# Altium schematic sheet STM32H730_PINOUT.SchDoc
size D; SheetNumber: 2; SheetTotal: 5
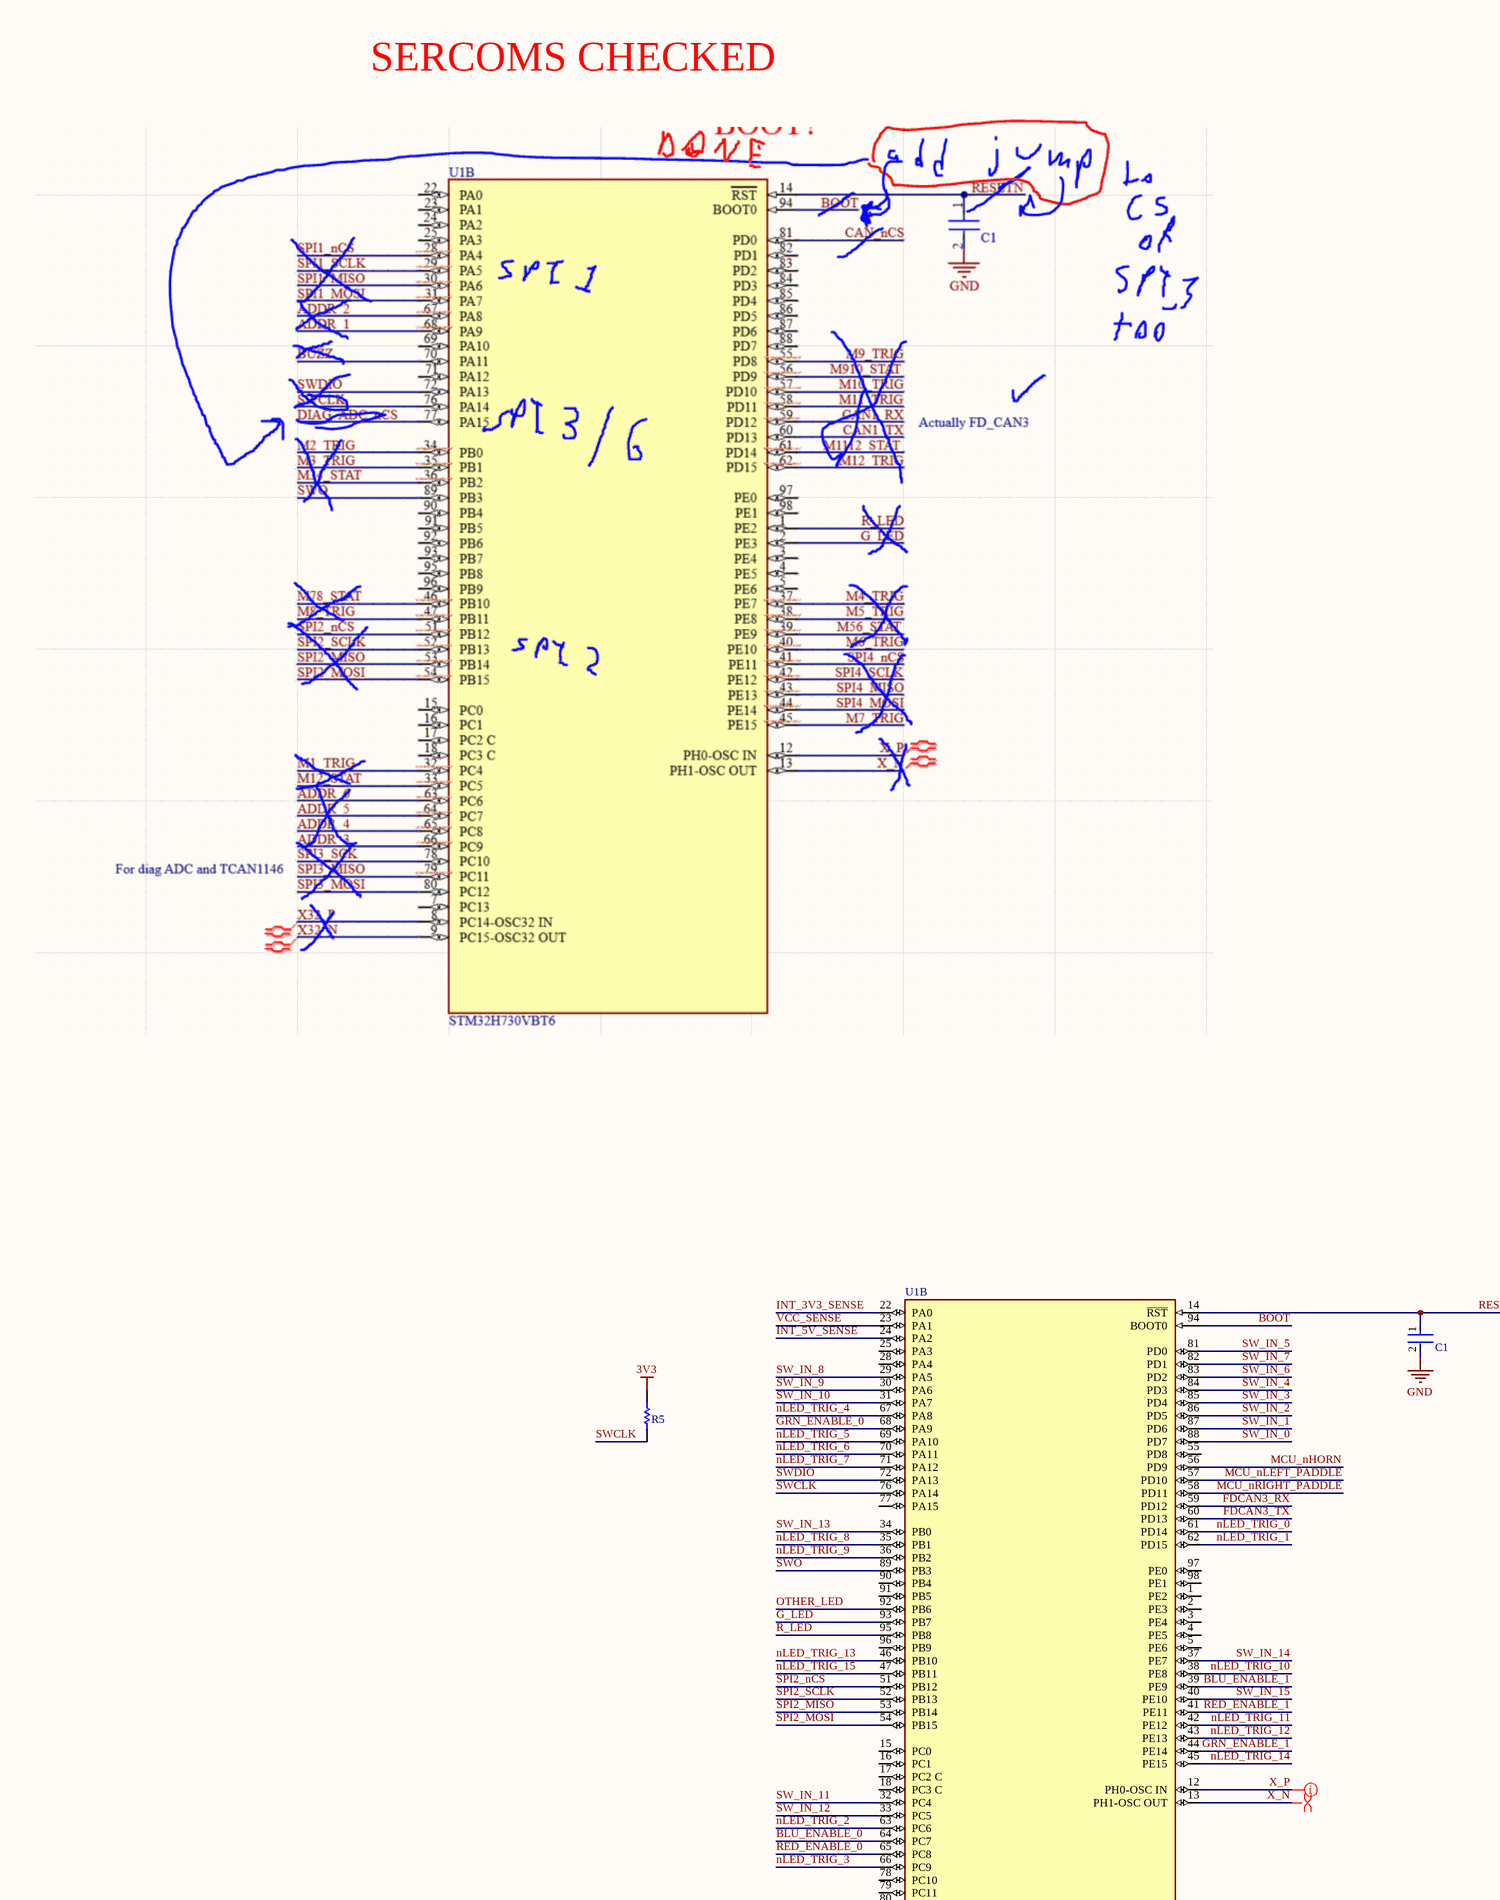
[diagram p0: STM32H730_PINOUT.SchDoc, top left]
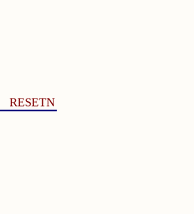
[diagram p1: STM32H730_PINOUT.SchDoc, top middle]
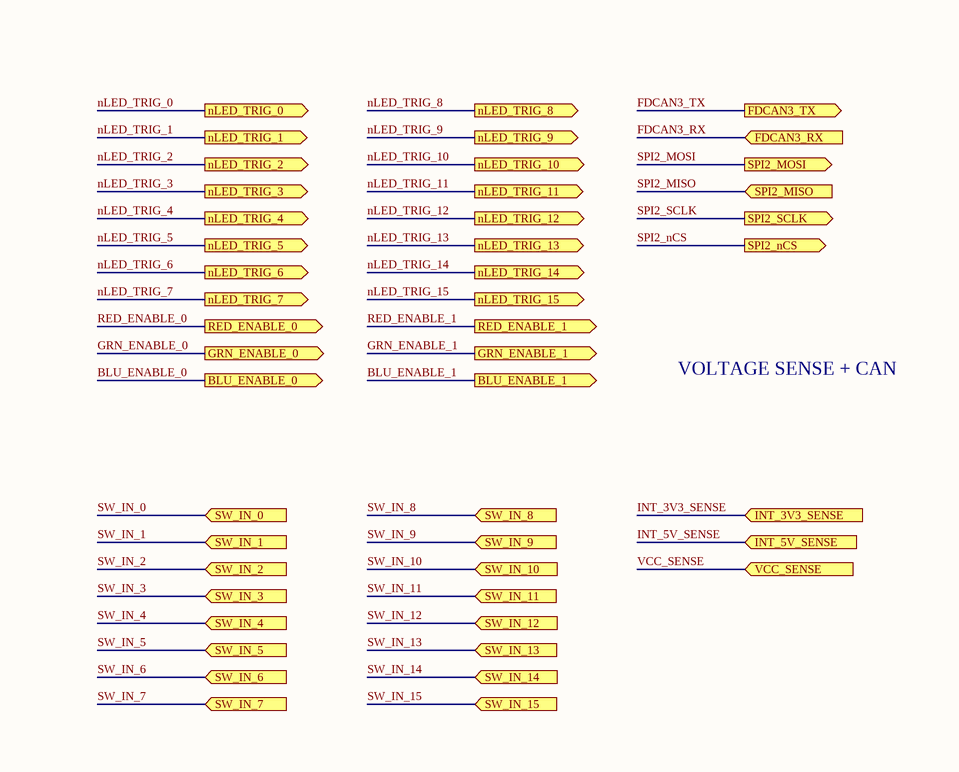
[diagram p2: STM32H730_PINOUT.SchDoc, top right]
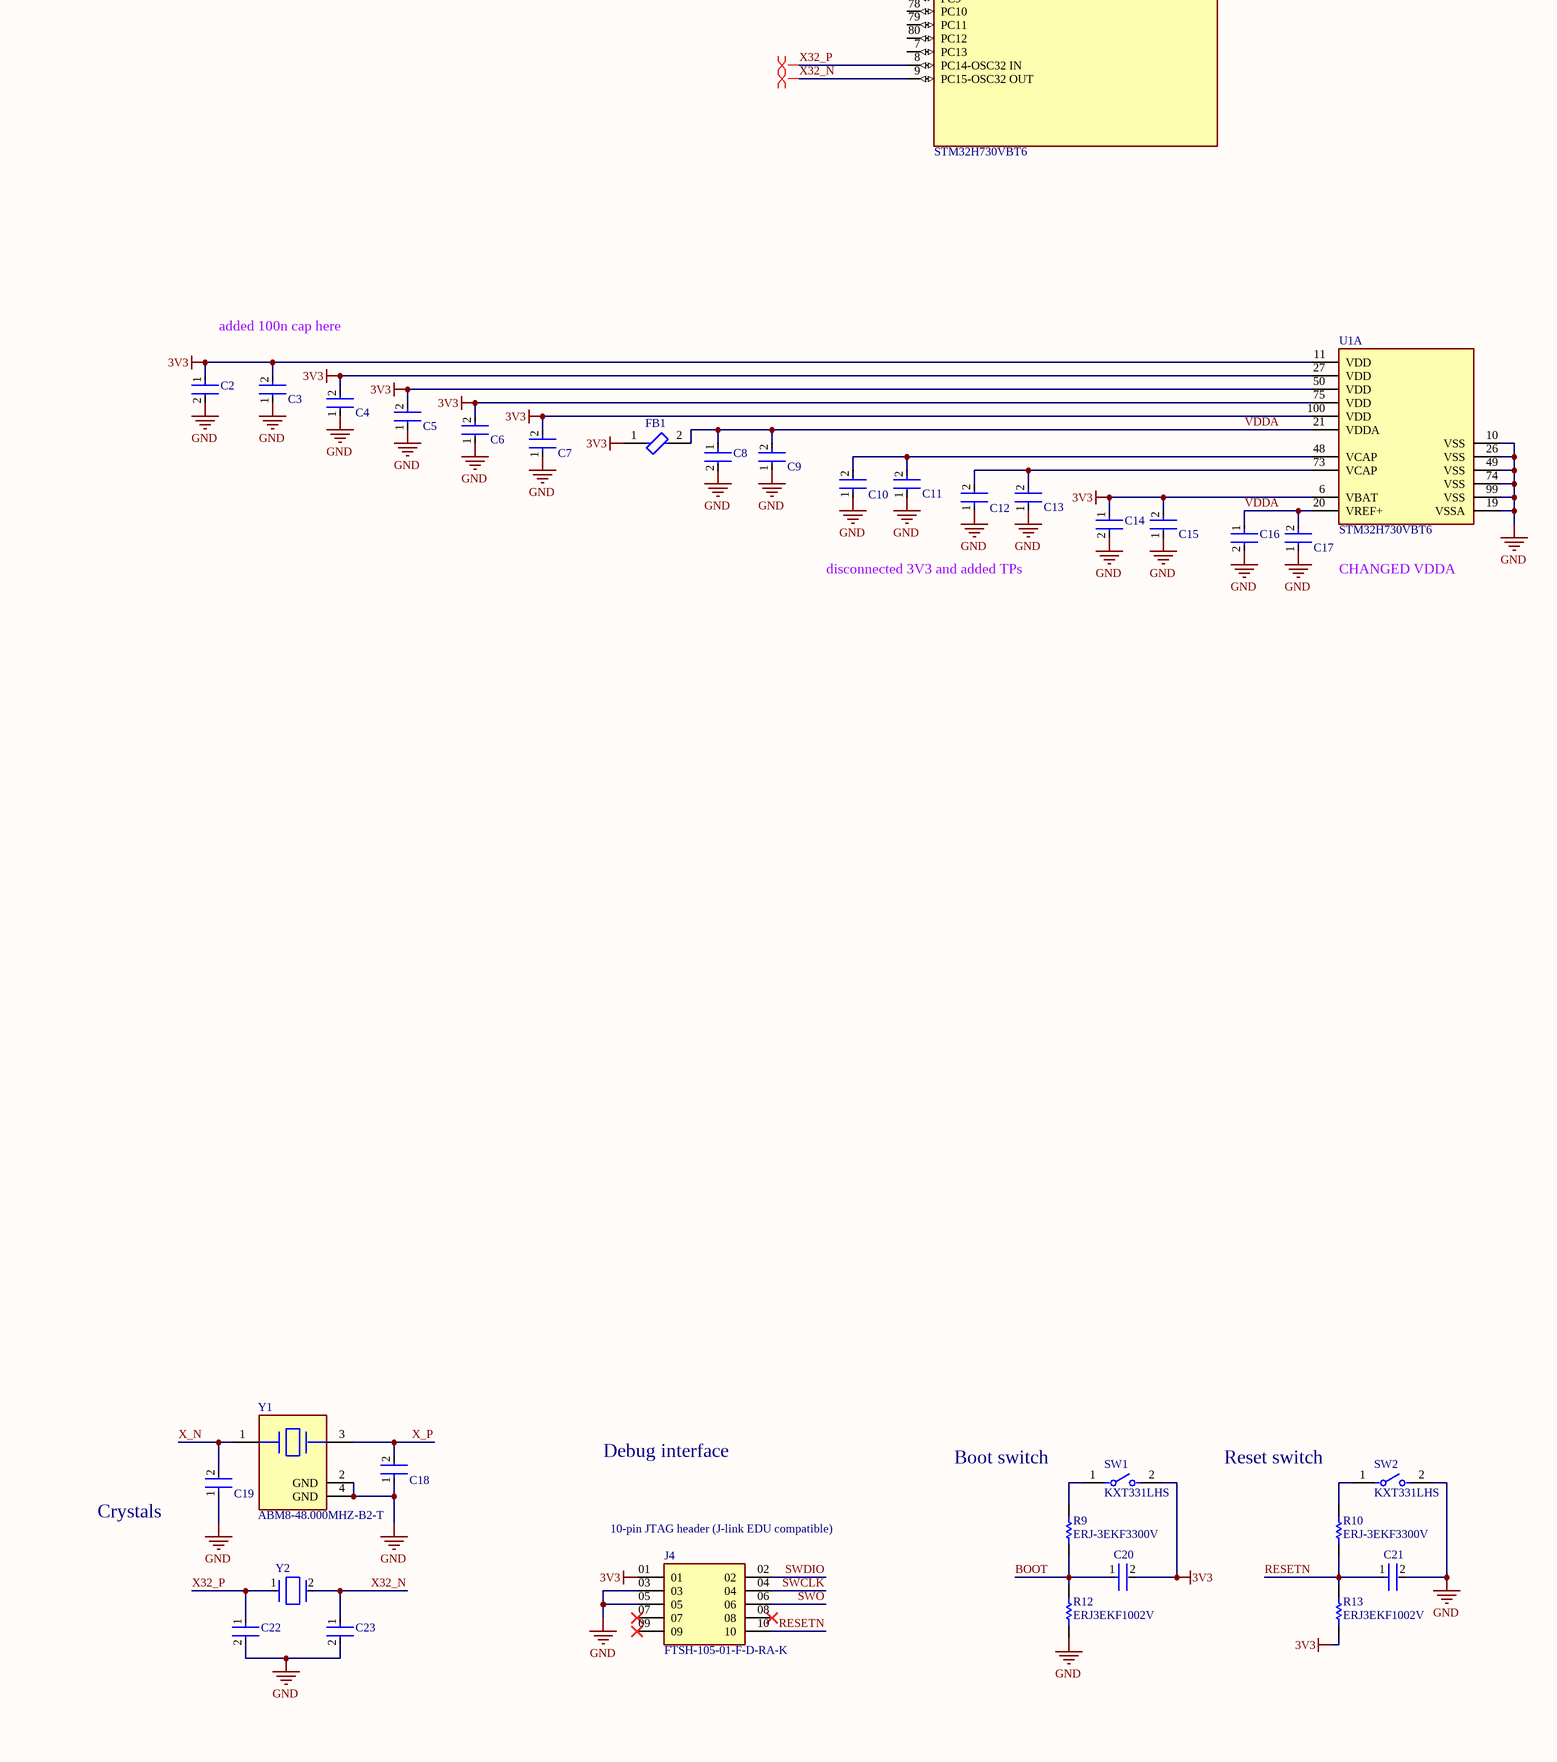
[diagram p3: STM32H730_PINOUT.SchDoc, bottom left]
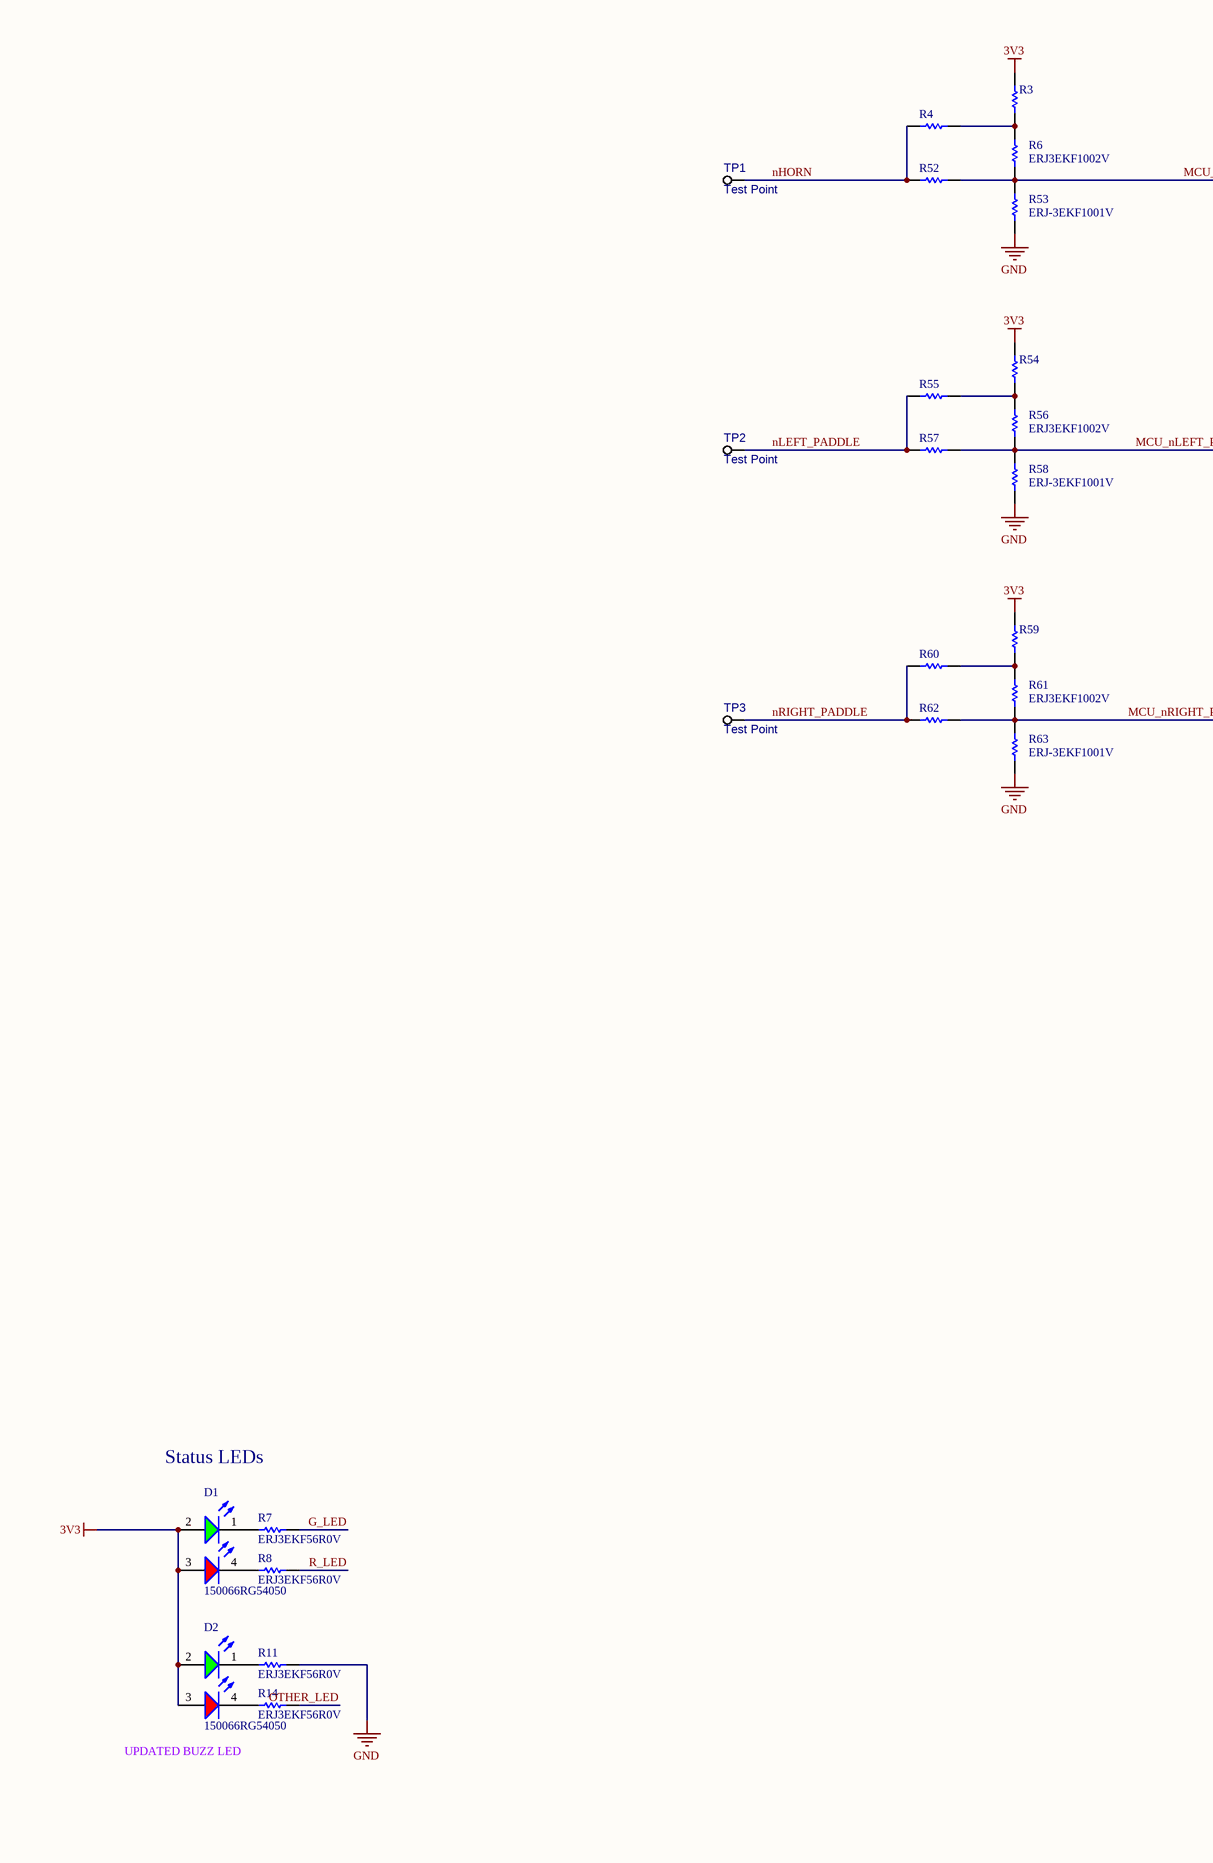
[diagram p4: STM32H730_PINOUT.SchDoc, bottom middle]
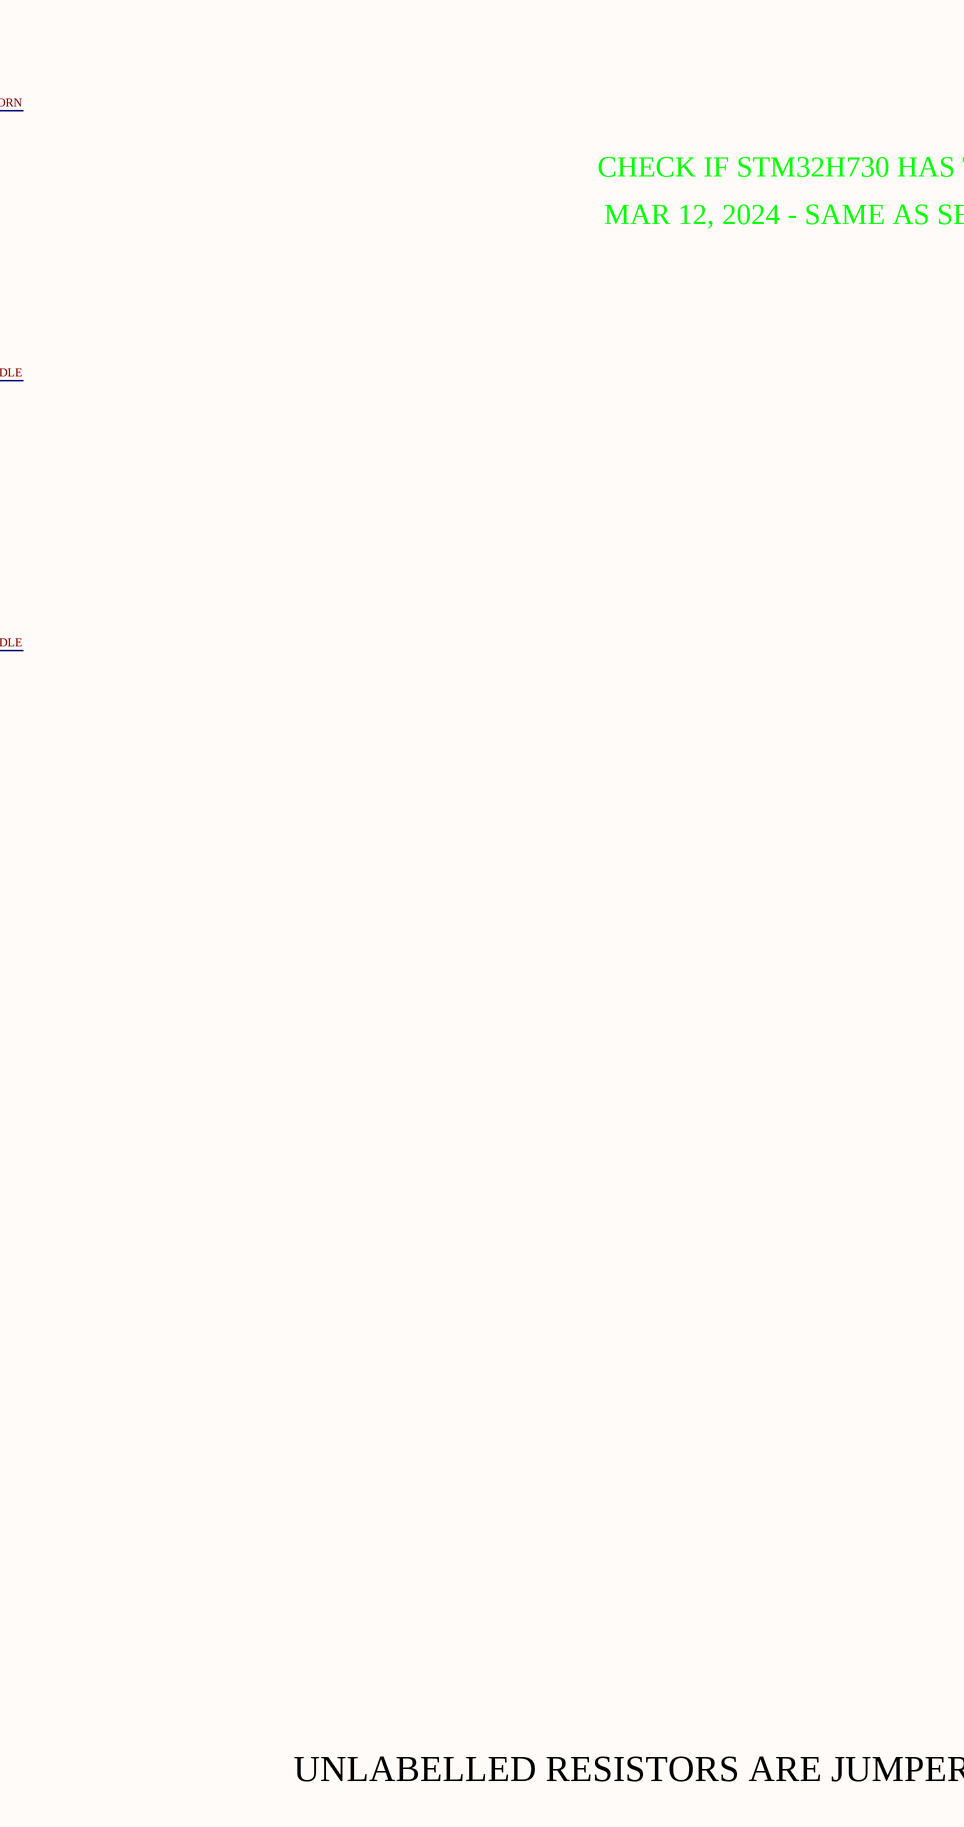
[diagram p5: STM32H730_PINOUT.SchDoc, bottom right]

## Parts
C1  C0402C104K8PACTU  [FP-C0402-BB-MFG]  (value not drawn)
C2  C1005X5R1A475K050BC  [FP-C1005-050-0_15-MFG]  (value not drawn)
C3  GRM155R71C104KA88D  [FP-GRM15-MFG]  (value not drawn)
C4  GRM155R71C104KA88D  [FP-GRM15-MFG]  (value not drawn)
C5  GRM155R71C104KA88D  [FP-GRM15-MFG]  (value not drawn)
C6  GRM155R71C104KA88D  [FP-GRM15-MFG]  (value not drawn)
C7  GRM155R71C104KA88D  [FP-GRM15-MFG]  (value not drawn)
C8  EMK105BJ105KV-F  [FP-0402-L_1_0_0_05-W_0_5-IPC_A]  (value not drawn)
C9  GRM155R71C104KA88D  [FP-GRM15-MFG]  (value not drawn)
C10  C1005X7S1A225K050BC  [FP-C1005-050-0_15-0_1-MFG]  (value not drawn)
C11  GRM155R71C104KA88D  [FP-GRM15-MFG]  (value not drawn)
C12  C1005X7S1A225K050BC  [FP-C1005-050-0_15-0_1-MFG]  (value not drawn)
C13  GRM155R71C104KA88D  [FP-GRM15-MFG]  (value not drawn)
C14  EMK105BJ105KV-F  [FP-0402-L_1_0_0_05-W_0_5-IPC_A]  (value not drawn)
C15  GRM155R71C104KA88D  [FP-GRM15-MFG]  (value not drawn)
C16  EMK105BJ105KV-F  [FP-0402-L_1_0_0_05-W_0_5-IPC_A]  (value not drawn)
C17  GRM155R71C104KA88D  [FP-GRM15-MFG]  (value not drawn)
C18  08051A6R8CAT2A  [FP-0805-L_2_01_0_2-W_1_25-MFG]  (value not drawn)
C19  08051A6R8CAT2A  [FP-0805-L_2_01_0_2-W_1_25-MFG]  (value not drawn)
C20  C0402C104K8PACTU  [FP-C0402-BB-MFG]  (value not drawn)
C21  C0402C104K8PACTU  [FP-C0402-BB-MFG]  (value not drawn)
C22  04025A180FAT2A  [FP-0402-L_1_0_1-W_0_5_0_1-IPC_A]  (value not drawn)
C23  04025A180FAT2A  [FP-0402-L_1_0_1-W_0_5_0_1-IPC_A]  (value not drawn)
D1  150066RG54050  [WL-SBCD_0606]
D2  150066RG54050  [WL-SBCD_0606]
FB1  BLM15PX601SN1D  [FP-BLM15-0_05-MFG]  (value not drawn)
J4  FTSH-105-01-F-D-RA-K  [FTSH-105-01-F-D-RA-K-Footprint-1]
R3  0402 JUMPER  [RESC1005X40X25ML05T05]  (value not drawn)
R4  0402 JUMPER  [RESC1005X40X25ML05T05]  (value not drawn)
R5  ERJ3EKF1002V  [RESC1609X55X30LL15T15]  (value not drawn)
R6  ERJ3EKF1002V  [RESC1609X55X30LL15T15]
R7  ERJ3EKF56R0V  [RESC1608X55X30NL15T15]
R8  ERJ3EKF56R0V  [RESC1608X55X30NL15T15]
R9  ERJ-3EKF3300V  [RESC1608X55X30LL15T15]
R10  ERJ-3EKF3300V  [RESC1608X55X30LL15T15]
R11  ERJ3EKF56R0V  [RESC1608X55X30NL15T15]
R12  ERJ3EKF1002V  [RESC1609X55X30LL15T15]
R13  ERJ3EKF1002V  [RESC1609X55X30LL15T15]
R14  ERJ3EKF56R0V  [RESC1608X55X30NL15T15]
R52  0402 JUMPER  [RESC1005X40X25ML05T05]  (value not drawn)
R53  ERJ-3EKF1001V  [RESC1608X55X30LL15T15]
R54  0402 JUMPER  [RESC1005X40X25ML05T05]  (value not drawn)
R55  0402 JUMPER  [RESC1005X40X25ML05T05]  (value not drawn)
R56  ERJ3EKF1002V  [RESC1609X55X30LL15T15]
R57  0402 JUMPER  [RESC1005X40X25ML05T05]  (value not drawn)
R58  ERJ-3EKF1001V  [RESC1608X55X30LL15T15]
R59  0402 JUMPER  [RESC1005X40X25ML05T05]  (value not drawn)
R60  0402 JUMPER  [RESC1005X40X25ML05T05]  (value not drawn)
R61  ERJ3EKF1002V  [RESC1609X55X30LL15T15]
R62  0402 JUMPER  [RESC1005X40X25ML05T05]  (value not drawn)
R63  ERJ-3EKF1001V  [RESC1608X55X30LL15T15]
SW1  KXT331LHS  [FP-KXT331LHS-MFG]
SW2  KXT331LHS  [FP-KXT331LHS-MFG]
TP1  Test Point  [TP-SMT-1mm]  (no BOM)
TP2  Test Point  [TP-SMT-1mm]  (no BOM)
TP3  Test Point  [TP-SMT-1mm]  (no BOM)
U1  STM32H730VBT6  [FP-LQFP100-1L-IPC_C]  (parts A,B of 2)
Y1  ABM8-48.000MHZ-B2-T  [FP-ABM8-MFG]
Y2  ECS-.327-12.5-1210-TR  [FP-ECX-1210-MFG]  (value not drawn)

## Ports
BLU_ENABLE_0 (out, see STEERING_WHEEL_SWITCHES_V2_CONTROLLER[5B]), BLU_ENABLE_1 (out, see STEERING_WHEEL_SWITCHES_V2_CONTROLLER[5B]), FDCAN3_RX (in, see STEERING_WHEEL_SWITCHES_V2_CONTROLLER[4B]), FDCAN3_TX (out, see STEERING_WHEEL_SWITCHES_V2_CONTROLLER[4B]), GRN_ENABLE_0 (out, see STEERING_WHEEL_SWITCHES_V2_CONTROLLER[5B]), GRN_ENABLE_1 (out, see STEERING_WHEEL_SWITCHES_V2_CONTROLLER[5B]), INT_3V3_SENSE (in, see STEERING_WHEEL_SWITCHES_V2_CONTROLLER[4A], PWR_MGMT[4B]), INT_5V_SENSE (in, see STEERING_WHEEL_SWITCHES_V2_CONTROLLER[4A], PWR_MGMT[4C]), nLED_TRIG_0 (out, see STEERING_WHEEL_SWITCHES_V2_CONTROLLER[5A], LED_ARRAY[1A]), nLED_TRIG_1 (out, see STEERING_WHEEL_SWITCHES_V2_CONTROLLER[5A], LED_ARRAY[1A]), nLED_TRIG_2 (out, see STEERING_WHEEL_SWITCHES_V2_CONTROLLER[5A], LED_ARRAY[1A]), nLED_TRIG_3 (out, see STEERING_WHEEL_SWITCHES_V2_CONTROLLER[5A], LED_ARRAY[1A]), nLED_TRIG_4 (out, see STEERING_WHEEL_SWITCHES_V2_CONTROLLER[5A], LED_ARRAY[1A]), nLED_TRIG_5 (out, see STEERING_WHEEL_SWITCHES_V2_CONTROLLER[5A], LED_ARRAY[1A]), nLED_TRIG_6 (out, see STEERING_WHEEL_SWITCHES_V2_CONTROLLER[5A], LED_ARRAY[1A]), nLED_TRIG_7 (out, see STEERING_WHEEL_SWITCHES_V2_CONTROLLER[5A], LED_ARRAY[1A]), nLED_TRIG_8 (out, see STEERING_WHEEL_SWITCHES_V2_CONTROLLER[5B]), nLED_TRIG_9 (out, see STEERING_WHEEL_SWITCHES_V2_CONTROLLER[5B]), nLED_TRIG_10 (out, see STEERING_WHEEL_SWITCHES_V2_CONTROLLER[5B]), nLED_TRIG_11 (out, see STEERING_WHEEL_SWITCHES_V2_CONTROLLER[5B]), nLED_TRIG_12 (out, see STEERING_WHEEL_SWITCHES_V2_CONTROLLER[5B]), nLED_TRIG_13 (out, see STEERING_WHEEL_SWITCHES_V2_CONTROLLER[5B]), nLED_TRIG_14 (out, see STEERING_WHEEL_SWITCHES_V2_CONTROLLER[5B]), nLED_TRIG_15 (out, see STEERING_WHEEL_SWITCHES_V2_CONTROLLER[5B]), RED_ENABLE_0 (out, see STEERING_WHEEL_SWITCHES_V2_CONTROLLER[5B]), RED_ENABLE_1 (out, see STEERING_WHEEL_SWITCHES_V2_CONTROLLER[5B]), SPI2_MISO (in, see STEERING_WHEEL_SWITCHES_V2_CONTROLLER[4B]), SPI2_MOSI (out, see STEERING_WHEEL_SWITCHES_V2_CONTROLLER[4B]), SPI2_nCS (out, see STEERING_WHEEL_SWITCHES_V2_CONTROLLER[4B]), SPI2_SCLK (out, see STEERING_WHEEL_SWITCHES_V2_CONTROLLER[4B]), SW_IN_0 (in, see STEERING_WHEEL_SWITCHES_V2_CONTROLLER[4B]), SW_IN_1 (in, see STEERING_WHEEL_SWITCHES_V2_CONTROLLER[4B]), SW_IN_2 (in, see STEERING_WHEEL_SWITCHES_V2_CONTROLLER[4B]), SW_IN_3 (in, see STEERING_WHEEL_SWITCHES_V2_CONTROLLER[4C]), SW_IN_4 (in, see STEERING_WHEEL_SWITCHES_V2_CONTROLLER[4C]), SW_IN_5 (in, see STEERING_WHEEL_SWITCHES_V2_CONTROLLER[4C]), SW_IN_6 (in, see STEERING_WHEEL_SWITCHES_V2_CONTROLLER[4C]), SW_IN_7 (in, see STEERING_WHEEL_SWITCHES_V2_CONTROLLER[4C]), SW_IN_8 (in, see STEERING_WHEEL_SWITCHES_V2_CONTROLLER[4C]), SW_IN_9 (in, see STEERING_WHEEL_SWITCHES_V2_CONTROLLER[4C]), SW_IN_10 (in, see STEERING_WHEEL_SWITCHES_V2_CONTROLLER[4C]), SW_IN_11 (in, see STEERING_WHEEL_SWITCHES_V2_CONTROLLER[4C]), SW_IN_12 (in, see STEERING_WHEEL_SWITCHES_V2_CONTROLLER[4C]), SW_IN_13 (in, see STEERING_WHEEL_SWITCHES_V2_CONTROLLER[4C]), SW_IN_14 (in, see STEERING_WHEEL_SWITCHES_V2_CONTROLLER[4C]), SW_IN_15 (in, see STEERING_WHEEL_SWITCHES_V2_CONTROLLER[4C]), VCC_SENSE (in, see STEERING_WHEEL_SWITCHES_V2_CONTROLLER[4A], PWR_MGMT[3C])

## Nets
3V3: C2.1 C3.2 C4.2 C5.2 C6.2 C7.2 C14.1 C15.2 C20.2 D1.2(A) D1.3(A) D2.2(A) D2.3(A) FB1.1 J4.01 R3.2 R5.1 R13.1 R54.2 R59.2 SW1.2 U1.6(VBAT) U1.11(VDD) U1.27(VDD) U1.50(VDD) U1.75(VDD) U1.100(VDD)
GND: C1.2 C2.2 C3.1 C4.1 C5.1 C6.1 C7.1 C8.2 C9.1 C10.1 C11.1 C12.1 C13.1 C14.2 C15.1 C16.2 C17.1 C18.1 C19.1 C21.2 C22.2 C23.2 J4.03 J4.05 R11.1 R12.1 R53.1 R58.1 R63.1 SW2.2 U1.10(VSS) U1.19(VSSA) U1.26(VSS) U1.49(VSS) U1.74(VSS) U1.99(VSS) Y1.2(GND) Y1.4(GND)
BLU_ENABLE_0: U1.64(PC7) ; port BLU_ENABLE_0
BLU_ENABLE_1: U1.39(PE9) ; port BLU_ENABLE_1
BOOT: C20.1 R9.1 R12.2 U1.94(BOOT0)
FDCAN3_RX: U1.59(PD12) ; port FDCAN3_RX
FDCAN3_TX: U1.60(PD13) ; port FDCAN3_TX
G_LED: R7.1 U1.93(PB7)
GRN_ENABLE_0: U1.68(PA9) ; port GRN_ENABLE_0
GRN_ENABLE_1: U1.44(PE14) ; port GRN_ENABLE_1
INT_3V3_SENSE: U1.22(PA0) ; port INT_3V3_SENSE
INT_5V_SENSE: U1.24(PA2) ; port INT_5V_SENSE
MCU_nHORN: R6.2 R52.2 R53.2 U1.56(PD9)
MCU_nLEFT_PADDLE: R56.2 R57.2 R58.2 U1.57(PD10)
MCU_nRIGHT_PADDLE: R61.2 R62.2 R63.2 U1.58(PD11)
nHORN: R4.1 R52.1 TP1.1(Pad)
nLED_TRIG_0: U1.61(PD14) ; port nLED_TRIG_0
nLED_TRIG_1: U1.62(PD15) ; port nLED_TRIG_1
nLED_TRIG_2: U1.63(PC6) ; port nLED_TRIG_2
nLED_TRIG_3: U1.66(PC9) ; port nLED_TRIG_3
nLED_TRIG_4: U1.67(PA8) ; port nLED_TRIG_4
nLED_TRIG_5: U1.69(PA10) ; port nLED_TRIG_5
nLED_TRIG_6: U1.70(PA11) ; port nLED_TRIG_6
nLED_TRIG_7: U1.71(PA12) ; port nLED_TRIG_7
nLED_TRIG_8: U1.35(PB1) ; port nLED_TRIG_8
nLED_TRIG_9: U1.36(PB2) ; port nLED_TRIG_9
nLED_TRIG_10: U1.38(PE8) ; port nLED_TRIG_10
nLED_TRIG_11: U1.42(PE12) ; port nLED_TRIG_11
nLED_TRIG_12: U1.43(PE13) ; port nLED_TRIG_12
nLED_TRIG_13: U1.46(PB10) ; port nLED_TRIG_13
nLED_TRIG_14: U1.45(PE15) ; port nLED_TRIG_14
nLED_TRIG_15: U1.47(PB11) ; port nLED_TRIG_15
nLEFT_PADDLE: R55.1 R57.1 TP2.1(Pad)
nRIGHT_PADDLE: R60.1 R62.1 TP3.1(Pad)
OTHER_LED: R14.1 U1.92(PB6)
R_LED: R8.1 U1.95(PB8)
RED_ENABLE_0: U1.65(PC8) ; port RED_ENABLE_0
RED_ENABLE_1: U1.41(PE11) ; port RED_ENABLE_1
RESETN: C1.1 C21.1 J4.10 R10.1 R13.2 U1.14(~{RST})
SPI2_MISO: U1.53(PB14) ; port SPI2_MISO
SPI2_MOSI: U1.54(PB15) ; port SPI2_MOSI
SPI2_nCS: U1.51(PB12) ; port SPI2_nCS
SPI2_SCLK: U1.52(PB13) ; port SPI2_SCLK
SW_IN_0: U1.88(PD7) ; port SW_IN_0
SW_IN_1: U1.87(PD6) ; port SW_IN_1
SW_IN_2: U1.86(PD5) ; port SW_IN_2
SW_IN_3: U1.85(PD4) ; port SW_IN_3
SW_IN_4: U1.84(PD3) ; port SW_IN_4
SW_IN_5: U1.81(PD0) ; port SW_IN_5
SW_IN_6: U1.83(PD2) ; port SW_IN_6
SW_IN_7: U1.82(PD1) ; port SW_IN_7
SW_IN_8: U1.29(PA5) ; port SW_IN_8
SW_IN_9: U1.30(PA6) ; port SW_IN_9
SW_IN_10: U1.31(PA7) ; port SW_IN_10
SW_IN_11: U1.32(PC4) ; port SW_IN_11
SW_IN_12: U1.33(PC5) ; port SW_IN_12
SW_IN_13: U1.34(PB0) ; port SW_IN_13
SW_IN_14: U1.37(PE7) ; port SW_IN_14
SW_IN_15: U1.40(PE10) ; port SW_IN_15
SWCLK: J4.04 R5.2 U1.76(PA14)
SWDIO: J4.02 U1.72(PA13)
SWO: J4.06 U1.89(PB3)
VCC_SENSE: U1.23(PA1) ; port VCC_SENSE
VDDA: C8.1 C9.2 C16.1 C17.2 FB1.2 U1.20(VREF+) U1.21(VDDA)
X32_N: C23.1 U1.9(PC15-OSC32_OUT) Y2.2(Out/In)
X32_P: C22.1 U1.8(PC14-OSC32_IN) Y2.1(In/Out)
X_N: C19.2 U1.13(PH1-OSC_OUT) Y1.1
X_P: C18.2 U1.12(PH0-OSC_IN) Y1.3
NetC10_2: C10.2 C11.2 U1.48(VCAP)
NetC12_2: C12.2 C13.2 U1.73(VCAP)
NetD1_1: D1.1(K) R7.2
NetD1_4: D1.4(K) R8.2
NetD2_1: D2.1(K) R11.2
NetD2_4: D2.4(K) R14.2
NetR3_1: R3.1 R4.2 R6.1
NetR9_2: R9.2 SW1.1
NetR10_2: R10.2 SW2.1
NetR54_1: R54.1 R55.2 R56.1
NetR59_1: R59.1 R60.2 R61.1

Not connected (* = marked no-connect by the designer): J4 07* 08* 09*; U1 1(PE2) 2(PE3) 3(PE4) 4(PE5) 5(PE6) 7(PC13) 15(PC0) 16(PC1) 17(PC2_C) 18(PC3_C) 25(PA3) 28(PA4) 55(PD8) 77(PA15) 78(PC10) 79(PC11) 80(PC12) 90(PB4) 91(PB5) 96(PB9) 97(PE0) 98(PE1)

## Layout directives
differential pair: X32_N, X32_P, X_N, X_P

## Notes on the sheet
- SERCOMS CHECKED
- VOLTAGE SENSE + CAN
- CHECK IF STM32H730 HAS TIMERS ON THESE PINS - IT DO
- MAR 12, 2024 - SAME AS SERCOM CHECK
- added 100n cap here
- disconnected 3V3 and added TPs
- CHANGED VDDA
- Status LEDs
- Debug interface
- Boot switch
- Reset switch
- (near C19) Crystals
- (near J4) 10-pin JTAG header (J-link EDU compatible)
- UPDATED BUZZ LED
- UNLABELLED RESISTORS ARE JUMPERS

## Library data of the parts
C1 C20 C21 = CMP-2008-02046-2: CAP CER 0.1UF 10V X5R 0402; Manufacturer: Kemet; Material: Ceramic; Capacitance: 0.10 μF; Temperature Coefficient: 15%; Tolerance: 0.1; Value: 0.10 μF; Package: C0402-BB; Temperature: -55°C to +125°C; ComponentLink2Description: Datasheet; Temperature Characteristic: X5R; Device Class L1: Passive Components; Height: 0.55mm; Lead Free: Yes; ComponentLink2URL: https://content.kemet.com/datasheets/KEM_C1002_X7R_SMD.pdf; Device Class L2: Capacitors; Temperature Range Low: -55°C; Temperature Range High: +125°C; RoHS: TRUE; Octopart: https://octopart.com/c0402c104k8pactu-kemet-140039; Automotive: No; Mouser Description: Capacitor 100 nF 10 VDC 0402; Category: Cap; Voltage Rating: 10 V; Digikey Description: CAP CER 0.1UF 10V X5R 0402; Ipc Land Pattern Name: CAPC10050X50; Device Class L3: Ceramic Capacitors; Manufacturer Part Number: C0402C104K8PACTU
C2 = CMP-2000-05997-2: CAP CER 4.7UF 10V X5R 0402; Dielectric Material: Ceramic; Tolerance: 10%; Series: C; Package Quantity: 10000; Max Operating Temperature: 85°C; Case Code (Imperial): 0402; Lead Free: Lead Free; Voltage Rating (DC): 10V; Packaging: Cut Tape; Voltage Rating: 10V; Min Operating Temperature: -55°C; Dielectric: X5R; Thickness: 0.022inch; Width: 0.02inch; Case/Package: 0402; Case Code (Metric): 1005; Capacitance: 4.7uF; Length: 0.039inch; RoHS Compliant: Yes; REACH SVHC: No SVHC; Mount: Surface Mount
C3-C7 C9 C11 C13 C15 C17 = CMP-2100-03641-2: CAP CER 0.1UF 16V X7R 0402; Manufacturer: Murata; Standoff Height: 0mm; Tolerance: 10%; Voltage Rating: 16Vdc; Material: Ceramic; Capacitance: 0.10μF; Value: 0.10μF; RoHS: TRUE; Manufacturer Part Number: GRM155R71C104KA88D; Temperature Characteristic: X7R; Octopart: https://octopart.com/grm155r71c104ka88d-murata-196880; Digikey Description: CAP CER 0.1UF 16V X7R 0402; Device Class L3: Ceramic Capacitors; Height: 0.55mm; ComponentLink2Description: Datasheet; Temperature Range Low: -55°C; Ipc Land Pattern Name: CAPC10050X219; ComponentLink2URL: https://search.murata.co.jp/Ceramy/image/img/A01X/G101/ENG/GRM155R71H471KA01-01A.pdf; Device Class L1: Passive Components; Lead Free: yes; Category: Cap; Package: GRM15; Temperature: -55°C to +125°C; Device Class L2: Capacitors; Temperature Range High: +125°C; Mouser Description: 0402 0.1 uF 16V ±10 % Tolerance X7R SMT Multilayer Ceramic Capacitor
C8 C14 C16 = CMP-14477-000104-2: None; Tolerance: 10%; Voltage Rating: 16V; Dielectric: X5R; Capacitance: 1uF; Packaging: Tape and Reel; Depth: 0.5mm; Mount: Surface Mount; Thickness: 0.022inch; Package Quantity: 1; Min Operating Temperature: -55°C; Series: M; Voltage Rating (DC): 16V; Termination: SMD/SMT; Case/Package: 0402; Number of Pins: 2; Case Code (Imperial): 0402; Length: 1mm; Halogen Free: Halogen Free; Case Code (Metric): 1005; Width: 0.02inch; RoHS Compliant: Yes; Radiation Hardening: No; Max Operating Temperature: 85°C; Height: 0.5mm; Construction: Flat
C10 C12 = CMP-08246-004344-1: CAP CER 2.2UF 10V X7S 0402; Dielectric Material: Ceramic; Tolerance: 10%; Mount: Surface Mount; Height: 0.5mm; Package Quantity: 1; Depth: 0.5mm; RoHS Compliant: Yes; Length: 1mm; Thickness: 0.022inch; Packaging: Tape and Reel; Capacitance: 2.2uF; Case Code (Imperial): 0402; Resistor Type: Ceramic; Dielectric: X7S; Case/Package: 0402; Min Operating Temperature: -55°C; Voltage Rating: 10V; Series: C; Weight: 2.3E-05oz; Width: 0.02inch; Voltage Rating (DC): 10V; Case Code (Metric): 1005; Max Operating Temperature: 125°C; Termination: SMD/SMT; Lead Free: Lead Free
C18 C19 = CMP-1036-00709-3: General Purpose Ceramic Capacitor, 0805, 6.8pF, 0.25pF, C0G, 30ppm/°C, 100V; Dissipation Factor: 10%; Insulation Resistance: 100GR; Tolerance: 5%; Max Operating Temperature: 125°C; RoHS Compliant: Yes; Capacitance: 6.8pF; Termination: SMD/SMT; Number of Pins: 2; Packaging: Tape and Reel; Mount: Surface Mount; Case Code (Metric): 2012; Case Code (Imperial): 0805; Height: 0.71mm; Min Operating Temperature: -55°C; Width: 0.049inch; Temperature Coefficient: 0ppm/°C; Length: 2.01mm; Dielectric: C0G; Series: -; Voltage Rating (DC): 100V; Dielectric Material: Ceramic; Depth: 1.25mm; Contact Plating: Tin; Voltage Rating: 100V; Thickness: 0.037inch; Case/Package: 0805; Lead Free: Lead Free; Radiation Hardening: No; Voltage: 100V; Construction: Flat; Package Quantity: 1; REACH SVHC: No SVHC
C22 C23 = CMP-2008-02590-2: General Purpose Ceramic Capacitor, 0402, 18pF, 1%, C0G, 30ppm/°C, 50V; Depth: 0.5mm; Packaging: Tape and Reel; Number of Pins: 2; Tolerance: 1%; Min Operating Temperature: -55°C; Capacitance: 18pF; Termination: SMD/SMT; Lead Free: Lead Free; Case Code (Metric): 1005; Radiation Hardening: No; Package Quantity: 1; Max Operating Temperature: 125°C; Voltage Rating: 50V; Construction: Flat; Dielectric: C0G; Length: 1mm; REACH SVHC: No SVHC; Case Code (Imperial): 0402; Series: -; RoHS Compliant: Yes; Voltage Rating (DC): 50V; Mount: Surface Mount; Case/Package: 0402; Width: 0.5mm; Thickness: 0.022inch; Contact Plating: Tin
D1 D2 = CMP-004-00040-2: Led, Red/Grn, 180Mcd/230Mcd, 624Nm/525Nm Rohs Compliant: Yes; Source: rgled.SchLib; Component Type: Standard; Design Item ID: CMP-004-00034-2; Pins: 4
FB1 = CMP-0686-00252-4: Chip Ferrite Bead, 0402, 600Ω @ 100MHz, 0.23Ω, 25%, 900mA; Number of Circuits: 1; Impedance: 600R; DC Resistance (DCR): 230mR; Material: Steel; Length: 1mm; Package Quantity: 10000; Height: 0.5mm; Width: 0.5mm; Max DC Current: 900mA; Number of Lines: 1; Termination: SMD/SMT; Packaging: Tape and Reel; Lead Free: Lead Free; Min Operating Temperature: -55°C; Max Operating Temperature: 125°C; Max Current Rating: 900mA; Case Code (Imperial): 0402; Number of Pins: 2; Current Rating: 900mA; Test Frequency: 100MHz; Case/Package: 0402; Tolerance: 25%; Case Code (Metric): 1005
J4 = CMP-002-00041-5: Board Connector, 10 Contact(s), 2 Row(s), Male, Right Angle, 0.05 inch Pitch, Surface Mount Terminal, Locking, Black Insulator; Connector Type: BOARD CONNECTOR; Mounting Technology: Board; RoHS Compliant: Yes
R3 R4 R52 R54 R55 R57 R59 R60 R62 = CMP-009-00118-2: READ THE NAME; Pins: 2; Component Type: Standard; Design Item ID: CMP-009-00206-2; Source: 0402jump.SchLib
R5 R6 R12 R13 R56 R61 = CMP-1012-00623-3: Chip Resistor, 10 KOhm, +/- 1%, 0.1 W, -55 to 155 degC, 0603 (1608 Metric), RoHS, Tape and Reel; Manufacturer: Panasonic; Voltage Rating: 75V; Case\/Package: 0603; Power Rating: 100mW; Resistance: 10KOhm; Temperature Coefficient: 100ppm\/degreesC; Number of Pins: 2; Package Reference: 603; Depth: 0.8mm; Mount: SurfaceMount; Package Description: 2-Pin Surface Mount Device, Body 1.6 x 0.85 mm; Datasheet Version: 02/2017; Length: 1.6mm; Lead Free: LeadFree; Height: 0.45mm; Number of Terminations: 2; Max Power Dissipation: 100mW; Min Operating Temperature: -55degC; Datasheet URL: https://industrial.panasonic.com/cdbs/www-data/pdf/RDA0000/AOA0000C304.pdf; Termination: SMD/SMT; Case Code (Metric): 1608; Case Code (Imperial): 0603; Tolerance: 1%; Max Operating Temperature: 155degC; RoHSCompliant: true; Voltage Rating (DC): 75V; Radiation Hardening: No; Packaging: TapeandReel; Composition: ThickFilm; Mounting Technology: SurfaceMount; Manufacturer URL: http://www.panasonic.com/; Width: 0.031inch; REACH SVHC: NoSVHC; Contact Plating: Tin; Military Standard: Not; Package Quantity: 1
R7 R8 R11 R14 = CMP-2000-00572-1: Manufacturer: Panasonic; Part Number: ERJ3EKF56R0V
R9 R10 = CMP-2000-00435-2: Chip Resistor, 330 Ohm, +/- 1%, 0.1 W, -55 to 155 degC, 0603 (1608 Metric), RoHS, Tape and Reel; Gender: Male; Mating Cycles: 10000; Current Rating: 500 mA; Voltage Rating: 10 V; REACH SVHC: No SVHC; PackageDescription: 2-Pin Surface Mount Device, Body 1.6 x 0.85 mm; Contact Finish: Gold; Pins: 8; ComponentLink1Description: Manufacturer URL; Packaging: Tape and Reel; Max Operating Temperature: 85 degC; Contact Material: Copper; Height: 1.45 mm; Width: 1.45 mm; DatasheetVersion: Apr-15; Package Quantity: 1500; Contact Plating: Gold; PackageReference: 0603; Mount: Surface Mount; Lead Pitch: 1.1 mm; Min Operating Temperature: -25 degC; ComponentLink1URL: http://www.panasonic.com/; ComponentLink2URL: http://industrial.panasonic.com/cdbs/www-data/pdf/RDA0000/AOA0000C86.pdf; Length: 13.7 mm; ComponentLink2Description: Datasheet; RoHSCompliant: true
R53 R58 R63 = CMP-2000-00180-1: Manufacturer: Panasonic; Part Number: ERJ-3EKF1001V
SW1 SW2 = CMP-10040-000029-1: SWITCH TACTILE SPST-NO 0.02A 15V; Operating Force: 240gf; Switch Travel: 0.13mm; Illumination Type: Non-Illuminated; Throw Configuration: SPST; Number of Ports: 1; Current Rating: 5A; Mechanical Life: 500000Cycles; Switch Function: Off-Mom; Connector Type: USB; Actuator Type: Standard; Gender: Receptacle; Number of Contacts: 24; Contact Plating: Gold; Insulation Color: Black; Min Operating Temperature: -40°C; Packaging: Tape and Reel; Flammability Rating: UL94 V-0; Max Operating Temperature: 85°C; Termination: Solder; Mount: Surface Mount
TP1-TP3 = CMP-002-00006-6: In circuit test point for a net
U1 = CMP-12105-000107-1: IC MCU 32BIT 128KB FLASH 100LQFP
Y1 = CMP-27762-011708-1: Crystal 48MHz ±20ppm 18pF SMD-4 3.2mm x 2.5mm; Series Resistance: 35R; Frequency Stability: 50ppm; Package Quantity: 1000; Packaging: Tape and Reel; Mount: Surface Mount; Length: 3.2mm; Load Capacitance: 18pF; Max Operating Temperature: 70°C; Operating Frequency: 48 MHz; RoHS Compliant: Yes; Series: ABM8; Frequency Tolerance: 20ppm; Lead Free: Lead Free; Min Operating Temperature: -20°C; Case/Package: CSMD; Number of Pins: 4; Height: 0.031inch; ESR (Equivalent Series Resistance): 35R; Frequency: 48MHz; Radiation Hardening: No; Width: 0.098inch; Tolerance: 20ppm; Termination: SMD/SMT; Depth: 2.5mm; Resistor Type: Ceramic; REACH SVHC: No SVHC
Y2 = CMP-40224-000006-1: CRYSTAL 32.7680KHZ 12.5PF SMD; Manufacturer: ECS International; Frequency: 32.768kHz; Esr: 90kΩ; Tolerance: 20ppm; Device Class L1: Passive Components; Load Capacitance: 12.5pF; Temperature: -40°C to +85°C; ComponentLink2URL: https://ecsxtal.com/store/pdf/ECX-1210.pdf; Series: ECX-1210; Octopart: https://octopart.com/ecs-.327-12.5-1210-tr-ecs+international-81221340; ComponentLink2Description: Datasheet; Temperature Range Low: -40°C; Digikey Description: CRYSTAL 32.7680KHZ 12.5PF SMD; Lead Free: Yes; RoHS: TRUE; Device Class L3: Crystals; Automotive: No; Category: Crys; Height: 0.5mm; Manufacturer Part Number: ECS-.327-12.5-1210-TR; Temperature Range High: +85°C; Device Class L2: Crystals / Oscillators; Package: ECX-1210